# Altium project auto_threader.PrjPcb (part 2 of 3)
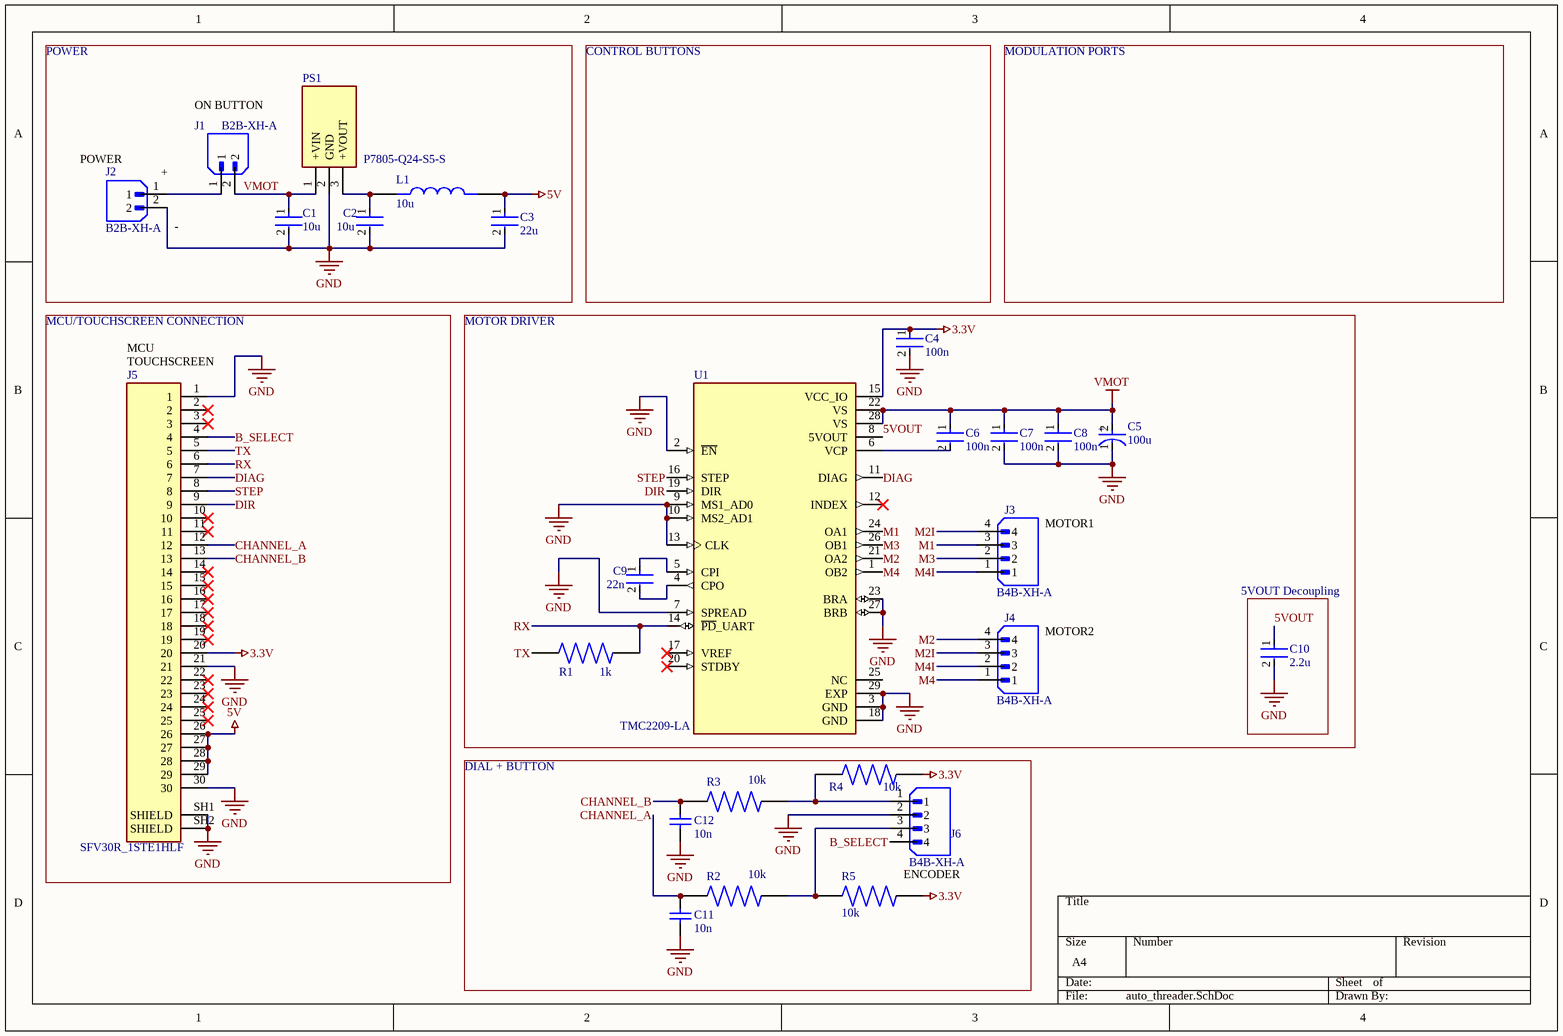
[diagram p1: auto_threader.SchDoc]

## Sheet auto_threader.SchDoc (continued)
### Library data of the parts
C1 = GRM21BR61H106KE43L: 50V 10uF X5R ±10% 0805 Multilayer Ceramic Capacitors MLCC - SMD/SMT ROHS; Manufacturer: Murata; Manufacturer Lifecycle Status: IN PRODUCTION; Value: 10µF; Supplier: DigiKey; Supplier Part Number: 490-18663-1-ND; Manufacturer Part Number: GRM21BR61H106KE43L; RoHS: Compliant; Category: Ceramic Capacitors; Stock: 1260835; Pricing: 1=0.31, 10=0.183, 50=0.133, 100=0.1177, 500=0.09208, 1000=0.08416 (USD); Case/Package: 0805; Country of Origin: Japan, Mainland China, Philippines, Singapore, Thailand; Dielectric: X5R; Dielectric Material: Ceramic; Export Control Classification Number (ECCN) Code: EAR99; Height: 1.25mm; Harmonized Tariff Schedule (HTS) Code: 8532.24.00.20; Introduction Date: 2018-09-13; Length: 2mm; Lifecycle Status: Production; Material: Ceramic; Max Operating Temperature: 85°C; Min Operating Temperature: -55°C; Mounting Technology: Surface Mount; Number of Terminals: 2; REACH SVHC: Yes; Thickness: 1.25mm; Tolerance: 10%; Voltage Rating: 50V; Voltage Rating (DC): 50V; Width: 1.25mm; ComponentLink1URL: https://datasheet.octopart.com:443/GRM21BR61H106KE43L-Murata-datasheet-155345082.pdf?src-supplier=Newark; ComponentLink1Description: https://datasheet.octopart.com:443/GRM21BR61H106KE43L-Murata-datasheet-155345082.pdf?src-supplier=Newark; ComponentLink2URL: https://datasheet.octopart.com:443/GRM21BR61H106KE43L-Murata-datasheet-141278272.pdf?src-supplier=Geoflip; ComponentLink2Description: https://datasheet.octopart.com:443/GRM21BR61H106KE43L-Murata-datasheet-141278272.pdf?src-supplier=Geoflip; ComponentLink3URL: https://datasheet.octopart.com:443/GRM21BR61H106KE43L-Murata-datasheet-165579666.pdf?src-supplier=TME; ComponentLink3Description: https://datasheet.octopart.com:443/GRM21BR61H106KE43L-Murata-datasheet-165579666.pdf?src-supplier=TME; ComponentLink4URL: https://datasheet.octopart.com:443/GRM21BR61H106KE43L-Murata-datasheet-140707579.pdf?src-supplier=Ciiva; ComponentLink4Description: https://datasheet.octopart.com:443/GRM21BR61H106KE43L-Murata-datasheet-140707579.pdf?src-supplier=Ciiva; ComponentLink5URL: https://datasheet.octopart.com:443/GRM21BR61H106KE43L-Murata-datasheet-138744880.pdf?src-supplier=Ciiva; ComponentLink5Description: https://datasheet.octopart.com:443/GRM21BR61H106KE43L-Murata-datasheet-138744880.pdf?src-supplier=Ciiva; ComponentLink6URL: https://datasheet.octopart.com/GRM21BR61H106KE43L-Murata-datasheet-12515295.pdf; ComponentLink6Description: https://datasheet.octopart.com/GRM21BR61H106KE43L-Murata-datasheet-12515295.pdf; ComponentLink7URL: https://datasheet.octopart.com/GRM21BR61H106KE43L-Murata-datasheet-12510076.pdf; ComponentLink7Description: https://datasheet.octopart.com/GRM21BR61H106KE43L-Murata-datasheet-12510076.pdf; ComponentLink8URL: https://datasheet.octopart.com/GRM21BR61H106KE43L-Murata-datasheet-11978611.pdf; ComponentLink8Description: https://datasheet.octopart.com/GRM21BR61H106KE43L-Murata-datasheet-11978611.pdf; ComponentLink9URL: https://datasheet.octopart.com/GRM21BR61H106KE43L-Murata-datasheet-10025737.pdf; ComponentLink9Description: https://datasheet.octopart.com/GRM21BR61H106KE43L-Murata-datasheet-10025737.pdf; ComponentLink10URL: https://datasheet.octopart.com/GRM21BR61H106KE43L-Murata-datasheet-8819587.pdf; ComponentLink10Description: https://datasheet.octopart.com/GRM21BR61H106KE43L-Murata-datasheet-8819587.pdf; ComponentLink11URL: http://sigma.octopart.com:80/reach_statement/Murata-company-16.pdf?src-supplier=Compliance+Statements; ComponentLink11Description: http://sigma.octopart.com:80/reach_statement/Murata-company-16.pdf?src-supplier=Compliance+Statements; Supplier 1: DigiKey; Supplier Part Number 1: 490-18663-1-ND
C2 = GRM21BR71A106KA73L: Chip Multilayer Ceramic Capacitors for General Purpose, 0805, 10uF, X7R, 15%, 10%, 10V; Length: 2mm; Case Code (Metric): 2012; Height: 1.25mm; Tolerance: 10%; Width: 1.25mm; Voltage Rating: 10V; Voltage Rating (DC): 10V; Case/Package: 0805; Package Quantity: 3000; Capacitance: 10uF; REACH SVHC: No SVHC; Case Code (Imperial): 0805; Min Operating Temperature: -55°C; Termination: SMD/SMT; Depth: 1.25mm; Mount: Surface Mount; Thickness: 0.055inch; Max Operating Temperature: 125°C; Weight: 0.000335oz; Dielectric: X7R; Packaging: Tape and Reel; Supplier 1: DigiKey; Supplier Part Number 1: 490-10516-1-ND
C3 = GRM188R61A226ME15D: 10V 22uF X5R ±20% 0603 Multilayer Ceramic Capacitors MLCC - SMD/SMT ROHS; Manufacturer: Murata; Manufacturer Lifecycle Status: IN PRODUCTION; Value: 22µF; Supplier: DigiKey; Supplier Part Number: 490-10476-1-ND; Manufacturer Part Number: GRM188R61A226ME15D; RoHS: Compliant; Category: Ceramic Capacitors; Stock: 3792271; Pricing: 1=0.16, 10=0.089, 50=0.0628, 100=0.0546, 500=0.04104, 1000=0.03687 (USD); Case/Package: 0603; Case Code (Imperial): 0603; Case Code (Metric): 1608; Depth: 800µm; Dielectric: X5R; Dielectric Material: Ceramic; Height: 800µm; Lead Free: Lead Free; Length: 1.6mm; Lifecycle Status: Production; Material: Ceramic; Max Operating Temperature: 85°C; Min Operating Temperature: -55°C; Mounting Technology: Surface Mount; Number of Terminals: 2; REACH SVHC: Yes; Schedule B: 8532240020, 8532240020|8532240020|8532240020|8532240020|8532240020|8532240020|8532240020|8532240020|8532240020|8532240020|8532240020|8532240020|8532240020|8532240020|8532240020|8532240020|8532240020|8532240020|8532240020|8532240020|8532240020|8532240020|8532240020|85; Termination: SMD/SMT; Thickness: 800µm; Tolerance: 20%; Voltage Rating: 10V; Voltage Rating (DC): 10V; Weight: 6.293594mg; Width: 800µm; ComponentLink1URL: https://datasheet.octopart.com:443/GRM188R61A226ME15D-Murata-datasheet-27203393.pdf?src-supplier=Newark; ComponentLink1Description: https://datasheet.octopart.com:443/GRM188R61A226ME15D-Murata-datasheet-27203393.pdf?src-supplier=Newark; ComponentLink2URL: https://datasheet.octopart.com:443/GRM188R61A226ME15D-Murata-datasheet-62317190.pdf?src-supplier=element14+APAC; ComponentLink2Description: https://datasheet.octopart.com:443/GRM188R61A226ME15D-Murata-datasheet-62317190.pdf?src-supplier=element14+APAC; ComponentLink3URL: https://datasheet.octopart.com:443/GRM188R61A226ME15D-Murata-datasheet-165579666.pdf?src-supplier=TME; ComponentLink3Description: https://datasheet.octopart.com:443/GRM188R61A226ME15D-Murata-datasheet-165579666.pdf?src-supplier=TME; ComponentLink4URL: https://datasheet.octopart.com:443/GRM188R61A226ME15D-Murata-datasheet-81639591.pdf?src-supplier=TME; ComponentLink4Description: https://datasheet.octopart.com:443/GRM188R61A226ME15D-Murata-datasheet-81639591.pdf?src-supplier=TME; ComponentLink5URL: https://datasheet.octopart.com:443/GRM188R61A226ME15D-Murata-datasheet-141274968.pdf?src-supplier=Ciiva; ComponentLink5Description: https://datasheet.octopart.com:443/GRM188R61A226ME15D-Murata-datasheet-141274968.pdf?src-supplier=Ciiva; ComponentLink6URL: https://datasheet.octopart.com:443/GRM188R61A226ME15D-Murata-datasheet-140704447.pdf?src-supplier=Ciiva; ComponentLink6Description: https://datasheet.octopart.com:443/GRM188R61A226ME15D-Murata-datasheet-140704447.pdf?src-supplier=Ciiva; ComponentLink7URL: https://datasheet.octopart.com:443/GRM188R61A226ME15D-Murata-datasheet-138742833.pdf?src-supplier=Ciiva; ComponentLink7Description: https://datasheet.octopart.com:443/GRM188R61A226ME15D-Murata-datasheet-138742833.pdf?src-supplier=Ciiva; ComponentLink8URL: https://datasheet.octopart.com/GRM188R61A226ME15D-Murata-datasheet-12515295.pdf; ComponentLink8Description: https://datasheet.octopart.com/GRM188R61A226ME15D-Murata-datasheet-12515295.pdf; ComponentLink9URL: https://datasheet.octopart.com/GRM188R61A226ME15D-Murata-datasheet-12510076.pdf; ComponentLink9Description: https://datasheet.octopart.com/GRM188R61A226ME15D-Murata-datasheet-12510076.pdf; ComponentLink10URL: https://datasheet.octopart.com/GRM188R61A226ME15D-Murata-datasheet-11978611.pdf; ComponentLink10Description: https://datasheet.octopart.com/GRM188R61A226ME15D-Murata-datasheet-11978611.pdf; ComponentLink11URL: https://datasheet.octopart.com/GRM188R61A226ME15D-Murata-datasheet-10025737.pdf; ComponentLink11Description: https://datasheet.octopart.com/GRM188R61A226ME15D-Murata-datasheet-10025737.pdf; ComponentLink12URL: https://datasheet.octopart.com/GRM188R61A226ME15D-Murata-datasheet-8819587.pdf; ComponentLink12Description: https://datasheet.octopart.com/GRM188R61A226ME15D-Murata-datasheet-8819587.pdf; ComponentLink13URL: https://datasheet.octopart.com/GRM188R61A226ME15D-Murata-datasheet-38883270.pdf; ComponentLink13Description: https://datasheet.octopart.com/GRM188R61A226ME15D-Murata-datasheet-38883270.pdf; ComponentLink14URL: https://datasheet.octopart.com:443/GRM188R61A226ME15D-Murata-datasheet-62287447.pdf?src-supplier=Future+Electronics; ComponentLink14Description: https://datasheet.octopart.com:443/GRM188R61A226ME15D-Murata-datasheet-62287447.pdf?src-supplier=Future+Electronics; ComponentLink15URL: http://sigma.octopart.com:80/reach_statement/Murata-company-16.pdf?src-supplier=Compliance+Statements; ComponentLink15Description: http://sigma.octopart.com:80/reach_statement/Murata-company-16.pdf?src-supplier=Compliance+Statements; Supplier 1: DigiKey; Supplier Part Number 1: 490-10476-1-ND
C4 C6-C8 = CC0805KRX7R9BB104: 50V 100nF X7R ±10% 0805 Multilayer Ceramic Capacitors MLCC - SMD/SMT ROHS; Manufacturer: Yageo Group; Manufacturer Package Identifier: CC0805-0.85; Insulation Resistance: 100GΩ; Supplier: DigiKey; Supplier Part Number: 311-1140-1-ND; Manufacturer Part Number: CC0805KRX7R9BB104; RoHS: Compliant; Category: Ceramic Capacitors; Stock: 986511; Pricing: 1=0.11, 10=0.06, 50=0.0412, 100=0.0356, 500=0.02612, 1000=0.02323 (USD); Value: 100nF; Case/Package: 0805; Case Code (Imperial): 0805; Case Code (Metric): 2012; China RoHS: Compliant; Country of Origin: Mainland China, Taiwan; Depth: 1.25mm; Dielectric: X7R; Dielectric Material: Ceramic; Export Control Classification Number (ECCN) Code: EAR99; Halogen Free: Halogen Free; Height: 850µm; Harmonized Tariff Schedule (HTS) Code: 8532.24.00.20; Introduction Date: 2003-01-27; Lead Free: Lead Free; Length: 2mm; Lifecycle Status: Production; Material: Ceramic; Max Operating Temperature: 125°C; Min Operating Temperature: -55°C; Mounting Technology: Surface Mount; Pins: 2; Number of Terminals: 2; Packaging: Cut Tape; Radiation Hardening: No; REACH SVHC: Yes; Schedule B: 8532240020, 8532240020|8532240020|8532240020|8532240020|8532240020|8532240020|8532240020|8532240020|8532240020|8532240020|8532240020|8532240020|8532240020|8532240020|8532240020|8532240020, 8532240020|8532240020|8532240020|8532240020|8532240020|8532240020|8532240020|8532240020|8532240020|8532240020|8532240020|8532240020|8532240020|8532240020|8532240020|8532240020|8532240020, 8532240020|8532240020|8532240020|8532240020|8532240020|8532240020|8532240020|8532240020|8532240020|8532240020|8532240020|8532240020|8532240020|8532240020|8532240020|8532240020|8532240020|8532240020; Termination: SMD/SMT; Thickness: 838.2µm; Tolerance: 10%; Voltage: 50V; Voltage Rating: 50V; Voltage Rating (DC): 50V; Width: 1.25mm; ComponentLink1URL: https://datasheet.octopart.com:443/CC0805KRX7R9BB104-Yageo-datasheet-177165144.pdf?src-supplier=IHS; ComponentLink1Description: https://datasheet.octopart.com:443/CC0805KRX7R9BB104-Yageo-datasheet-177165144.pdf?src-supplier=IHS; ComponentLink2URL: https://datasheet.octopart.com:443/CC0805KRX7R9BB104-Yageo-datasheet-78855689.pdf?src-supplier=Upverter; ComponentLink2Description: https://datasheet.octopart.com:443/CC0805KRX7R9BB104-Yageo-datasheet-78855689.pdf?src-supplier=Upverter; ComponentLink3URL: https://datasheet.octopart.com:443/CC0805KRX7R9BB104-Yageo-datasheet-68298032.pdf?src-supplier=Upverter; ComponentLink3Description: https://datasheet.octopart.com:443/CC0805KRX7R9BB104-Yageo-datasheet-68298032.pdf?src-supplier=Upverter; ComponentLink4URL: https://datasheet.octopart.com:443/CC0805KRX7R9BB104-Yageo-Group-datasheet-189192896.pdf?src-supplier=Future+Electronics; ComponentLink4Description: https://datasheet.octopart.com:443/CC0805KRX7R9BB104-Yageo-Group-datasheet-189192896.pdf?src-supplier=Future+Electronics; ComponentLink5URL: https://datasheet.octopart.com:443/CC0805KRX7R9BB104-Yageo-datasheet-166511530.pdf?src-supplier=Future+Electronics; ComponentLink5Description: https://datasheet.octopart.com:443/CC0805KRX7R9BB104-Yageo-datasheet-166511530.pdf?src-supplier=Future+Electronics; ComponentLink6URL: https://datasheet.octopart.com:443/CC0805KRX7R9BB104-Yageo-datasheet-137700082.pdf?src-supplier=Future+Electronics; ComponentLink6Description: https://datasheet.octopart.com:443/CC0805KRX7R9BB104-Yageo-datasheet-137700082.pdf?src-supplier=Future+Electronics; ComponentLink7URL: https://datasheet.octopart.com:443/CC0805KRX7R9BB104-Yageo-datasheet-137700084.pdf?src-supplier=Future+Electronics; ComponentLink7Description: https://datasheet.octopart.com:443/CC0805KRX7R9BB104-Yageo-datasheet-137700084.pdf?src-supplier=Future+Electronics; ComponentLink8URL: https://datasheet.octopart.com:443/CC0805KRX7R9BB104-Yageo-datasheet-82288757.pdf?src-supplier=Future+Electronics; ComponentLink8Description: https://datasheet.octopart.com:443/CC0805KRX7R9BB104-Yageo-datasheet-82288757.pdf?src-supplier=Future+Electronics; ComponentLink9URL: https://datasheet.octopart.com:443/CC0805KRX7R9BB104-Yageo-datasheet-62139192.pdf?src-supplier=Future+Electronics; ComponentLink9Description: https://datasheet.octopart.com:443/CC0805KRX7R9BB104-Yageo-datasheet-62139192.pdf?src-supplier=Future+Electronics; ComponentLink10URL: https://datasheet.octopart.com:443/CC0805KRX7R9BB104-Yageo-datasheet-27626582.pdf?src-supplier=Future+Electronics; ComponentLink10Description: https://datasheet.octopart.com:443/CC0805KRX7R9BB104-Yageo-datasheet-27626582.pdf?src-supplier=Future+Electronics; ComponentLink11URL: https://datasheet.octopart.com:443/CC0805KRX7R9BB104-Yageo-datasheet-15895757.pdf?src-supplier=Future+Electronics; ComponentLink11Description: https://datasheet.octopart.com:443/CC0805KRX7R9BB104-Yageo-datasheet-15895757.pdf?src-supplier=Future+Electronics; ComponentLink12URL: https://datasheet.octopart.com:443/CC0805KRX7R9BB104-Yageo-datasheet-12526321.pdf?src-supplier=Future+Electronics; ComponentLink12Description: https://datasheet.octopart.com:443/CC0805KRX7R9BB104-Yageo-datasheet-12526321.pdf?src-supplier=Future+Electronics; ComponentLink13URL: https://datasheet.octopart.com:443/CC0805KRX7R9BB104-Yageo-datasheet-8324192.pdf?src-supplier=Future+Electronics; ComponentLink13Description: https://datasheet.octopart.com:443/CC0805KRX7R9BB104-Yageo-datasheet-8324192.pdf?src-supplier=Future+Electronics; ComponentLink14URL: https://datasheet.octopart.com/CC0805KRX7R9BB104-Yageo-datasheet-10883670.pdf; ComponentLink14Description: https://datasheet.octopart.com/CC0805KRX7R9BB104-Yageo-datasheet-10883670.pdf; ComponentLink15URL: https://datasheet.octopart.com:443/CC0805KRX7R9BB104-Yageo-datasheet-62336348.pdf?src-supplier=Newark; ComponentLink15Description: https://datasheet.octopart.com:443/CC0805KRX7R9BB104-Yageo-datasheet-62336348.pdf?src-supplier=Newark; ComponentLink16URL: https://datasheet.octopart.com:443/CC0805KRX7R9BB104-Yageo-datasheet-181969852.pdf?src-supplier=Newark; ComponentLink16Description: https://datasheet.octopart.com:443/CC0805KRX7R9BB104-Yageo-datasheet-181969852.pdf?src-supplier=Newark; ComponentLink17URL: https://datasheet.octopart.com:443/CC0805KRX7R9BB104-Yageo-datasheet-181969851.pdf?src-supplier=Newark; ComponentLink17Description: https://datasheet.octopart.com:443/CC0805KRX7R9BB104-Yageo-datasheet-181969851.pdf?src-supplier=Newark; ComponentLink18URL: https://datasheet.octopart.com:443/CC0805KRX7R9BB104-Phycomp-datasheet-499490.pdf?src-supplier=Newark; ComponentLink18Description: https://datasheet.octopart.com:443/CC0805KRX7R9BB104-Phycomp-datasheet-499490.pdf?src-supplier=Newark; ComponentLink19URL: https://datasheet.octopart.com:443/CC0805KRX7R9BB104-Yageo-datasheet-147453679.pdf?src-supplier=element14+APAC; ComponentLink19Description: https://datasheet.octopart.com:443/CC0805KRX7R9BB104-Yageo-datasheet-147453679.pdf?src-supplier=element14+APAC; ComponentLink20URL: https://datasheet.octopart.com:443/CC0805KRX7R9BB104-Yageo-datasheet-151948686.pdf?src-supplier=Farnell; ComponentLink20Description: https://datasheet.octopart.com:443/CC0805KRX7R9BB104-Yageo-datasheet-151948686.pdf?src-supplier=Farnell; ComponentLink21URL: https://datasheet.octopart.com:443/CC0805KRX7R9BB104-Yageo-Group-datasheet-188689702.pdf?src-supplier=Farnell; ComponentLink21Description: https://datasheet.octopart.com:443/CC0805KRX7R9BB104-Yageo-Group-datasheet-188689702.pdf?src-supplier=Farnell; ComponentLink22URL: https://datasheet.octopart.com:443/CC0805KRX7R9BB104-Phycomp-datasheet-500777.pdf?src-supplier=Farnell; ComponentLink22Description: https://datasheet.octopart.com:443/CC0805KRX7R9BB104-Phycomp-datasheet-500777.pdf?src-supplier=Farnell; ComponentLink23URL: https://datasheet.octopart.com:443/CC0805KRX7R9BB104-Yageo-Group-datasheet-165992755.pdf?src-supplier=ODG+(Origin+Data+Global); ComponentLink23Description: https://datasheet.octopart.com:443/CC0805KRX7R9BB104-Yageo-Group-datasheet-165992755.pdf?src-supplier=ODG+(Origin+Data+Global); ComponentLink24URL: https://datasheet.octopart.com:443/CC0805KRX7R9BB104-Yageo-datasheet-140260305.pdf?src-supplier=SOS+electronic; ComponentLink24Description: https://datasheet.octopart.com:443/CC0805KRX7R9BB104-Yageo-datasheet-140260305.pdf?src-supplier=SOS+electronic; ComponentLink25URL: https://datasheet.octopart.com:443/CC0805KRX7R9BB104-Yageo-datasheet-120101875.pdf?src-supplier=Megastar; ComponentLink25Description: https://datasheet.octopart.com:443/CC0805KRX7R9BB104-Yageo-datasheet-120101875.pdf?src-supplier=Megastar; ComponentLink26URL: https://datasheet.octopart.com:443/CC0805KRX7R9BB104-Yageo-datasheet-8701427.pdf?src-supplier=element14; ComponentLink26Description: https://datasheet.octopart.com:443/CC0805KRX7R9BB104-Yageo-datasheet-8701427.pdf?src-supplier=element14; ComponentLink27URL: https://datasheet.octopart.com:443/CC0805KRX7R9BB104-Yageo-datasheet-5301394.pdf?src-supplier=element14; ComponentLink27Description: https://datasheet.octopart.com:443/CC0805KRX7R9BB104-Yageo-datasheet-5301394.pdf?src-supplier=element14; ComponentLink28URL: https://datasheet.octopart.com:443/CC0805KRX7R9BB104-Yageo-datasheet-17600895.pdf?src-supplier=TME; ComponentLink28Description: https://datasheet.octopart.com:443/CC0805KRX7R9BB104-Yageo-datasheet-17600895.pdf?src-supplier=TME; ComponentLink29URL: https://datasheet.octopart.com:443/CC0805KRX7R9BB104-Yageo-datasheet-118396.pdf?src-supplier=DigiKey; ComponentLink29Description: https://datasheet.octopart.com:443/CC0805KRX7R9BB104-Yageo-datasheet-118396.pdf?src-supplier=DigiKey; ComponentLink30URL: http://sigma.octopart.com:80/conflict_mineral_statement/Yageo-company-3.pdf?src-supplier=Compliance+Statements; ComponentLink30Description: http://sigma.octopart.com:80/conflict_mineral_statement/Yageo-company-3.pdf?src-supplier=Compliance+Statements; ComponentLink31URL: http://sigma.octopart.com:80/rohs_statement/Yageo-company-2.pdf?src-supplier=Compliance+Statements; ComponentLink31Description: http://sigma.octopart.com:80/rohs_statement/Yageo-company-2.pdf?src-supplier=Compliance+Statements; Supplier 1: DigiKey; Supplier Part Number 1: 311-1140-1-ND
C5 = 35ZLH100MEFC6.3X11: Aluminum Electrolytic Capacitors-DIP DIP, D6.3xL11mm 100μF ±20% 35V 94mΩ 540mA 6000Hrs@105℃; Manufacturer: Rubycon; Dielectric Material: Aluminium; Dissipation Factor: 12%; Lead Diameter: 500µm; Leakage Current: 35µA; Life (Hours): 6000hours; Ripple Current: 270mA; Supplier: DigiKey; Supplier Part Number: 1189-1300-ND; Manufacturer Part Number: 35ZLH100MEFC6.3X11; RoHS: Compliant; Category: Aluminum Electrolytic Capacitors; Stock: 118937; Pricing: 1=0.33, 10=0.203, 50=0.148, 100=0.1304, 500=0.09992, 2000=0.08229, 4000=0.07562, 6000=0.07225 (USD); Value: 100µF; Case/Package: Radial; Country of Origin: Japan; Diameter: 6.3mm; Export Control Classification Number (ECCN) Code: EAR99; Height: 12.5mm; Height - Seated (Max): 12.4968mm; Harmonized Tariff Schedule (HTS) Code: 8532.22.00.20; Impedance: 94mΩ; Introduction Date: 2010-09-20; Lead Pitch: 2.5mm; Length: 11mm; Lifecycle Status: Production; Max Operating Temperature: 105°C; Min Operating Temperature: -40°C; Mounting Technology: Through Hole; Pins: 2; Number of Terminals: 2; Packaging: Bulk; Radiation Hardening: No; REACH SVHC: Yes; Ripple Current (AC): 540mA; Schedule B: 8532220020, 8532220020|8532220020|8532220020|8532220020|8532220020|8532220020|8532220020|8532220020|8532220020|8532220020|8532220020|8532220020|8532220020|8532220020|8532220020|8532220020|8532220020|8532220020|8532220020|8532220020|8532220020|8532220020|8532220020|85; Terminal Pitch: 2.5mm; Termination: Radial; Tolerance: 20%; Voltage: 35V; Voltage Rating: 35V; Voltage Rating (AC): 35V; Voltage Rating (DC): 35V; ComponentLink1URL: https://datasheet.octopart.com:443/35ZLH100MEFC6.3X11-Rubycon-datasheet-181960486.pdf?src-supplier=IHS; ComponentLink1Description: https://datasheet.octopart.com:443/35ZLH100MEFC6.3X11-Rubycon-datasheet-181960486.pdf?src-supplier=IHS; ComponentLink2URL: https://datasheet.octopart.com:443/35ZLH100MEFC6.3X11-Rubycon-datasheet-12510202.pdf?src-supplier=LKR; ComponentLink2Description: https://datasheet.octopart.com:443/35ZLH100MEFC6.3X11-Rubycon-datasheet-12510202.pdf?src-supplier=LKR; ComponentLink3URL: https://datasheet.octopart.com:443/35ZLH100MEFC6.3X11-Rubycon-datasheet-154841597.pdf?src-supplier=JRH+Electronics; ComponentLink3Description: https://datasheet.octopart.com:443/35ZLH100MEFC6.3X11-Rubycon-datasheet-154841597.pdf?src-supplier=JRH+Electronics; ComponentLink4URL: https://datasheet.octopart.com:443/35ZLH100MEFC6.3X11-Rubycon-datasheet-66579747.pdf?src-supplier=Newark; ComponentLink4Description: https://datasheet.octopart.com:443/35ZLH100MEFC6.3X11-Rubycon-datasheet-66579747.pdf?src-supplier=Newark; ComponentLink5URL: https://datasheet.octopart.com:443/35ZLH100MEFC6.3X11-Rubycon-datasheet-41194731.pdf?src-supplier=Newark; ComponentLink5Description: https://datasheet.octopart.com:443/35ZLH100MEFC6.3X11-Rubycon-datasheet-41194731.pdf?src-supplier=Newark; ComponentLink6URL: https://datasheet.octopart.com:443/35ZLH100MEFC6.3X11-Rubycon-datasheet-10030022.pdf?src-supplier=element14+APAC; ComponentLink6Description: https://datasheet.octopart.com:443/35ZLH100MEFC6.3X11-Rubycon-datasheet-10030022.pdf?src-supplier=element14+APAC; ComponentLink7URL: https://datasheet.octopart.com:443/35ZLH100MEFC6.3X11-Rubycon-datasheet-8493648.pdf?src-supplier=element14+APAC; ComponentLink7Description: https://datasheet.octopart.com:443/35ZLH100MEFC6.3X11-Rubycon-datasheet-8493648.pdf?src-supplier=element14+APAC; ComponentLink8URL: https://datasheet.octopart.com:443/35ZLH100MEFC6.3X11-Rubycon-datasheet-7128063.pdf?src-supplier=element14+APAC; ComponentLink8Description: https://datasheet.octopart.com:443/35ZLH100MEFC6.3X11-Rubycon-datasheet-7128063.pdf?src-supplier=element14+APAC; ComponentLink9URL: https://datasheet.octopart.com:443/35ZLH100MEFC6.3X11-Rubycon-datasheet-86451566.pdf?src-supplier=Master+Electronics; ComponentLink9Description: https://datasheet.octopart.com:443/35ZLH100MEFC6.3X11-Rubycon-datasheet-86451566.pdf?src-supplier=Master+Electronics; Supplier 1: DigiKey; Supplier Part Number 1: 1189-1300-ND
C9 = CC0603KRX7R9BB223: Surface Mount Ceramic Multilayer Capacitor 0.022uF 10% X7R 50V 0603 Paper T/R; Manufacturer: Yageo Group; Value: 22nF; Insulation Resistance: 100GΩ; Supplier: DigiKey; Supplier Part Number: 311-1370-1-ND; Manufacturer Part Number: CC0603KRX7R9BB223; RoHS: Compliant; Category: Ceramic Capacitors; Stock: 1263; Pricing: 1=0.1, 10=0.042, 50=0.0288, 100=0.0247, 500=0.01782, 1000=0.0157 (USD); Case/Package: 0603; Case Code (Imperial): 0603; Case Code (Metric): 1608; China RoHS: Compliant; Composition: Ceramic; Country of Origin: Mainland China, Taiwan; Depth: 800µm; Dielectric: X7R; Dielectric Material: Ceramic; Export Control Classification Number (ECCN) Code: EAR99; Halogen Free: Halogen Free; Height: 800µm; Harmonized Tariff Schedule (HTS) Code: 8532.24.00.20; Introduction Date: 2003-01-27; Lead Free: Lead Free; Length: 1.6mm; Lifecycle Status: Production; Material: Ceramic; Max Operating Temperature: 125°C; Min Operating Temperature: -55°C; Mounting Technology: Surface Mount; Pins: 2; Number of Terminals: 2; Packaging: Cut Tape (CT); Radiation Hardening: No; REACH SVHC: Yes; Schedule B: 8532240020, 8532240020|8532240020, 8532240020|8532240020|8532240020, 8532240020|8532240020|8532240020|8532240020; Termination: SMD/SMT; Thickness: 889µm; Tolerance: 10%; Voltage: 50V; Voltage Rating: 50V; Voltage Rating (AC): 50V; Voltage Rating (DC): 50V; Width: 800µm; ComponentLink1URL: https://datasheet.octopart.com:443/CC0603KRX7R9BB223-Yageo-datasheet-177165144.pdf?src-supplier=IHS; ComponentLink1Description: https://datasheet.octopart.com:443/CC0603KRX7R9BB223-Yageo-datasheet-177165144.pdf?src-supplier=IHS; ComponentLink2URL: https://datasheet.octopart.com/CC0603KRX7R9BB223-Yageo-datasheet-10883670.pdf; ComponentLink2Description: https://datasheet.octopart.com/CC0603KRX7R9BB223-Yageo-datasheet-10883670.pdf; ComponentLink3URL: https://datasheet.octopart.com:443/CC0603KRX7R9BB223-Yageo-datasheet-147453679.pdf?src-supplier=Newark; ComponentLink3Description: https://datasheet.octopart.com:443/CC0603KRX7R9BB223-Yageo-datasheet-147453679.pdf?src-supplier=Newark; ComponentLink4URL: https://datasheet.octopart.com:443/CC0603KRX7R9BB223-Yageo-datasheet-499490.pdf?src-supplier=Newark; ComponentLink4Description: https://datasheet.octopart.com:443/CC0603KRX7R9BB223-Yageo-datasheet-499490.pdf?src-supplier=Newark; ComponentLink5URL: https://datasheet.octopart.com:443/CC0603KRX7R9BB223-Yageo-datasheet-5301394.pdf?src-supplier=Newark; ComponentLink5Description: https://datasheet.octopart.com:443/CC0603KRX7R9BB223-Yageo-datasheet-5301394.pdf?src-supplier=Newark; ComponentLink6URL: https://sigma.octopart.com:443/147830939/technical_drawing/Yageo-CC0603KRX7R9BB223.pdf?src-supplier=Upverter; ComponentLink6Description: https://sigma.octopart.com:443/147830939/technical_drawing/Yageo-CC0603KRX7R9BB223.pdf?src-supplier=Upverter; ComponentLink7URL: https://datasheet.octopart.com:443/CC0603KRX7R9BB223-Yageo-datasheet-82288757.pdf?src-supplier=Upverter; ComponentLink7Description: https://datasheet.octopart.com:443/CC0603KRX7R9BB223-Yageo-datasheet-82288757.pdf?src-supplier=Upverter; ComponentLink8URL: https://datasheet.octopart.com:443/CC0603KRX7R9BB223-Yageo-datasheet-62139192.pdf?src-supplier=Upverter; ComponentLink8Description: https://datasheet.octopart.com:443/CC0603KRX7R9BB223-Yageo-datasheet-62139192.pdf?src-supplier=Upverter; ComponentLink9URL: https://datasheet.octopart.com:443/CC0603KRX7R9BB223-Yageo-Group-datasheet-189192896.pdf?src-supplier=Future+Electronics; ComponentLink9Description: https://datasheet.octopart.com:443/CC0603KRX7R9BB223-Yageo-Group-datasheet-189192896.pdf?src-supplier=Future+Electronics; ComponentLink10URL: https://datasheet.octopart.com:443/CC0603KRX7R9BB223-Yageo-datasheet-166511530.pdf?src-supplier=Future+Electronics; ComponentLink10Description: https://datasheet.octopart.com:443/CC0603KRX7R9BB223-Yageo-datasheet-166511530.pdf?src-supplier=Future+Electronics; ComponentLink11URL: https://datasheet.octopart.com:443/CC0603KRX7R9BB223-Yageo-datasheet-137700082.pdf?src-supplier=Future+Electronics; ComponentLink11Description: https://datasheet.octopart.com:443/CC0603KRX7R9BB223-Yageo-datasheet-137700082.pdf?src-supplier=Future+Electronics; ComponentLink12URL: https://datasheet.octopart.com:443/CC0603KRX7R9BB223-Yageo-datasheet-137700084.pdf?src-supplier=Future+Electronics; ComponentLink12Description: https://datasheet.octopart.com:443/CC0603KRX7R9BB223-Yageo-datasheet-137700084.pdf?src-supplier=Future+Electronics; ComponentLink13URL: https://datasheet.octopart.com:443/CC0603KRX7R9BB223-Yageo-datasheet-15895757.pdf?src-supplier=Future+Electronics; ComponentLink13Description: https://datasheet.octopart.com:443/CC0603KRX7R9BB223-Yageo-datasheet-15895757.pdf?src-supplier=Future+Electronics; ComponentLink14URL: https://datasheet.octopart.com:443/CC0603KRX7R9BB223-Yageo-datasheet-12526321.pdf?src-supplier=Future+Electronics; ComponentLink14Description: https://datasheet.octopart.com:443/CC0603KRX7R9BB223-Yageo-datasheet-12526321.pdf?src-supplier=Future+Electronics; ComponentLink15URL: https://datasheet.octopart.com:443/CC0603KRX7R9BB223-Yageo-datasheet-8324192.pdf?src-supplier=Future+Electronics; ComponentLink15Description: https://datasheet.octopart.com:443/CC0603KRX7R9BB223-Yageo-datasheet-8324192.pdf?src-supplier=Future+Electronics; ComponentLink16URL: https://datasheet.octopart.com:443/CC0603KRX7R9BB223-Yageo-datasheet-62336348.pdf?src-supplier=Farnell; ComponentLink16Description: https://datasheet.octopart.com:443/CC0603KRX7R9BB223-Yageo-datasheet-62336348.pdf?src-supplier=Farnell; ComponentLink17URL: https://datasheet.octopart.com:443/CC0603KRX7R9BB223-Yageo-datasheet-151948686.pdf?src-supplier=Farnell; ComponentLink17Description: https://datasheet.octopart.com:443/CC0603KRX7R9BB223-Yageo-datasheet-151948686.pdf?src-supplier=Farnell; ComponentLink18URL: https://datasheet.octopart.com:443/CC0603KRX7R9BB223-Yageo-datasheet-500777.pdf?src-supplier=Farnell; ComponentLink18Description: https://datasheet.octopart.com:443/CC0603KRX7R9BB223-Yageo-datasheet-500777.pdf?src-supplier=Farnell; ComponentLink19URL: https://datasheet.octopart.com:443/CC0603KRX7R9BB223-Yageo-datasheet-27626582.pdf?src-supplier=Seeed+Studio; ComponentLink19Description: https://datasheet.octopart.com:443/CC0603KRX7R9BB223-Yageo-datasheet-27626582.pdf?src-supplier=Seeed+Studio; ComponentLink20URL: https://datasheet.octopart.com:443/CC0603KRX7R9BB223-Yageo-datasheet-178019131.pdf?src-supplier=Burklin+Elektronik; ComponentLink20Description: https://datasheet.octopart.com:443/CC0603KRX7R9BB223-Yageo-datasheet-178019131.pdf?src-supplier=Burklin+Elektronik; ComponentLink21URL: https://datasheet.octopart.com:443/CC0603KRX7R9BB223-Yageo-Group-datasheet-165992755.pdf?src-supplier=ODG+(Origin+Data+Global); ComponentLink21Description: https://datasheet.octopart.com:443/CC0603KRX7R9BB223-Yageo-Group-datasheet-165992755.pdf?src-supplier=ODG+(Origin+Data+Global); ComponentLink22URL: https://datasheet.octopart.com:443/CC0603KRX7R9BB223-Yageo-datasheet-140260305.pdf?src-supplier=SOS+electronic; ComponentLink22Description: https://datasheet.octopart.com:443/CC0603KRX7R9BB223-Yageo-datasheet-140260305.pdf?src-supplier=SOS+electronic; ComponentLink23URL: https://datasheet.octopart.com:443/CC0603KRX7R9BB223-Yageo-datasheet-120101875.pdf?src-supplier=Megastar; ComponentLink23Description: https://datasheet.octopart.com:443/CC0603KRX7R9BB223-Yageo-datasheet-120101875.pdf?src-supplier=Megastar; ComponentLink24URL: https://datasheet.octopart.com:443/CC0603KRX7R9BB223-Yageo-datasheet-8701427.pdf?src-supplier=element14; ComponentLink24Description: https://datasheet.octopart.com:443/CC0603KRX7R9BB223-Yageo-datasheet-8701427.pdf?src-supplier=element14; ComponentLink25URL: https://datasheet.octopart.com:443/CC0603KRX7R9BB223-Yageo-datasheet-17600895.pdf?src-supplier=TME; ComponentLink25Description: https://datasheet.octopart.com:443/CC0603KRX7R9BB223-Yageo-datasheet-17600895.pdf?src-supplier=TME; ComponentLink26URL: http://sigma.octopart.com:80/conflict_mineral_statement/Yageo-company-3.pdf?src-supplier=Compliance+Statements; ComponentLink26Description: http://sigma.octopart.com:80/conflict_mineral_statement/Yageo-company-3.pdf?src-supplier=Compliance+Statements; ComponentLink27URL: http://sigma.octopart.com:80/rohs_statement/Yageo-company-2.pdf?src-supplier=Compliance+Statements; ComponentLink27Description: http://sigma.octopart.com:80/rohs_statement/Yageo-company-2.pdf?src-supplier=Compliance+Statements; Supplier 1: DigiKey; Supplier Part Number 1: 311-1370-1-ND
C10 = GRM155C80J225KE95D: 6.3V 2.2uF X6S ±10% 0402 Multilayer Ceramic Capacitors MLCC - SMD/SMT ROHS; Manufacturer: Murata; Manufacturer Lifecycle Status: IN PRODUCTION; Value: 2.2µF; Supplier: DigiKey; Supplier Part Number: 490-10012-1-ND; Manufacturer Part Number: GRM155C80J225KE95D; RoHS: Compliant; Category: Ceramic Capacitors; Stock: 4107485; Pricing: 1=0.1, 10=0.057, 50=0.039, 100=0.0336, 500=0.02462, 1000=0.02186, 2500=0.01896, 5000=0.01722 (USD); Case/Package: 0402; Case Code (Imperial): 0402; Case Code (Metric): 1005; Country of Origin: Japan, Mainland China, Philippines, Singapore, Thailand; Dielectric: X6S; Dielectric Material: Ceramic; Export Control Classification Number (ECCN) Code: EAR99; Height: 500µm; Harmonized Tariff Schedule (HTS) Code: 8532.24.00.20; Introduction Date: 2012-07-24; Length: 1mm; Lifecycle Status: Production; Material: Ceramic; Max Operating Temperature: 105°C; Min Operating Temperature: -55°C; Mounting Technology: Surface Mount; Number of Terminals: 2; Packaging: Tape & Reel (TR); REACH SVHC: Yes; Schedule B: 8532240020, 8532240020|8532240020|8532240020|8532240020|8532240020|8532240020|8532240020|8532240020|8532240020|8532240020|8532240020|8532240020|8532240020|8532240020|8532240020|8532240020|8532240020|8532240020|8532240020|8532240020|8532240020|8532240020|8532240020|85; Thickness: 500µm; Tolerance: 10%; Voltage Rating: 6.3V; Voltage Rating (DC): 6.3V; Width: 500µm; ComponentLink1URL: https://datasheet.octopart.com:443/GRM155C80J225KE95D-Murata-datasheet-149522920.pdf?src-supplier=Newark; ComponentLink1Description: https://datasheet.octopart.com:443/GRM155C80J225KE95D-Murata-datasheet-149522920.pdf?src-supplier=Newark; ComponentLink2URL: https://datasheet.octopart.com:443/GRM155C80J225KE95D-Murata-datasheet-179080476.pdf?src-supplier=Arrow.cn; ComponentLink2Description: https://datasheet.octopart.com:443/GRM155C80J225KE95D-Murata-datasheet-179080476.pdf?src-supplier=Arrow.cn; ComponentLink3URL: https://datasheet.octopart.com:443/GRM155C80J225KE95D-Murata-datasheet-165579666.pdf?src-supplier=TME; ComponentLink3Description: https://datasheet.octopart.com:443/GRM155C80J225KE95D-Murata-datasheet-165579666.pdf?src-supplier=TME; ComponentLink4URL: https://datasheet.octopart.com:443/GRM155C80J225KE95D-Murata-datasheet-141266224.pdf?src-supplier=Ciiva; ComponentLink4Description: https://datasheet.octopart.com:443/GRM155C80J225KE95D-Murata-datasheet-141266224.pdf?src-supplier=Ciiva; ComponentLink5URL: https://datasheet.octopart.com:443/GRM155C80J225KE95D-Murata-datasheet-140688039.pdf?src-supplier=Ciiva; ComponentLink5Description: https://datasheet.octopart.com:443/GRM155C80J225KE95D-Murata-datasheet-140688039.pdf?src-supplier=Ciiva; ComponentLink6URL: https://datasheet.octopart.com:443/GRM155C80J225KE95D-Murata-datasheet-138740490.pdf?src-supplier=Ciiva; ComponentLink6Description: https://datasheet.octopart.com:443/GRM155C80J225KE95D-Murata-datasheet-138740490.pdf?src-supplier=Ciiva; ComponentLink7URL: https://datasheet.octopart.com:443/GRM155C80J225KE95D-Murata-datasheet-32479577.pdf?src-supplier=Future+Electronics; ComponentLink7Description: https://datasheet.octopart.com:443/GRM155C80J225KE95D-Murata-datasheet-32479577.pdf?src-supplier=Future+Electronics; ComponentLink8URL: https://datasheet.octopart.com/GRM155C80J225KE95D-Murata-datasheet-12515295.pdf; ComponentLink8Description: https://datasheet.octopart.com/GRM155C80J225KE95D-Murata-datasheet-12515295.pdf; ComponentLink9URL: https://datasheet.octopart.com/GRM155C80J225KE95D-Murata-datasheet-12510076.pdf; ComponentLink9Description: https://datasheet.octopart.com/GRM155C80J225KE95D-Murata-datasheet-12510076.pdf; ComponentLink10URL: https://datasheet.octopart.com/GRM155C80J225KE95D-Murata-datasheet-11978611.pdf; ComponentLink10Description: https://datasheet.octopart.com/GRM155C80J225KE95D-Murata-datasheet-11978611.pdf; ComponentLink11URL: https://datasheet.octopart.com/GRM155C80J225KE95D-Murata-datasheet-10025737.pdf; ComponentLink11Description: https://datasheet.octopart.com/GRM155C80J225KE95D-Murata-datasheet-10025737.pdf; ComponentLink12URL: https://datasheet.octopart.com/GRM155C80J225KE95D-Murata-datasheet-8819587.pdf; ComponentLink12Description: https://datasheet.octopart.com/GRM155C80J225KE95D-Murata-datasheet-8819587.pdf; ComponentLink13URL: https://datasheet.octopart.com/GRM155C80J225KE95D-Murata-datasheet-15634835.pdf; ComponentLink13Description: https://datasheet.octopart.com/GRM155C80J225KE95D-Murata-datasheet-15634835.pdf; ComponentLink14URL: http://sigma.octopart.com:80/reach_statement/Murata-company-16.pdf?src-supplier=Compliance+Statements; ComponentLink14Description: http://sigma.octopart.com:80/reach_statement/Murata-company-16.pdf?src-supplier=Compliance+Statements; Supplier 1: DigiKey; Supplier Part Number 1: 490-10012-1-ND
C11 C12 = GCM188R71H103KA37D: 50V 10nF X7R ±10% 0603 Multilayer Ceramic Capacitors MLCC - SMD/SMT ROHS; Manufacturer: Murata; Manufacturer Lifecycle Status: NRND; Supplier: DigiKey; Supplier Part Number: 490-4778-1-ND; Manufacturer Part Number: GCM188R71H103KA37D; RoHS: Compliant; Category: Ceramic Capacitors; Stock: 5464610; Pricing: 1=0.12, 10=0.065, 50=0.045, 100=0.0389, 500=0.02872, 1000=0.02559 (USD); Value: 10nF; Case/Package: 0603; Case Code (Imperial): 0603; Case Code (Metric): 1608; Country of Origin: Philippines; Depth: 800µm; Dielectric: X7R; Dielectric Material: Ceramic; Export Control Classification Number (ECCN) Code: EAR99; Height: 800µm; Harmonized Tariff Schedule (HTS) Code: 8532.24.00.20; Introduction Date: 2007-06-21; Lead Free: Lead Free; Length: 1.6mm; Lifecycle Status: NRND; Max Operating Temperature: 125°C; Min Operating Temperature: -55°C; Mounting Technology: Surface Mount; Number of Terminals: 2; Packaging: Cut Tape; Radiation Hardening: No; Ratings: AEC-Q200; REACH SVHC: Yes; Schedule B: 8532240020, 8532240020|8532240020, 8532240020|8532240020|8532240020, 8532240020|8532240020|8532240020|8532240020; Termination: SMD/SMT; Tolerance: 10%; Voltage: 50V; Voltage Rating: 50V; Voltage Rating (DC): 50V; Width: 800µm; ComponentLink1URL: https://datasheet.octopart.com:443/GCM188R71H103KA37D-Murata-datasheet-39128445.pdf?src-supplier=Newark; ComponentLink1Description: https://datasheet.octopart.com:443/GCM188R71H103KA37D-Murata-datasheet-39128445.pdf?src-supplier=Newark; ComponentLink2URL: https://datasheet.octopart.com:443/GCM188R71H103KA37D-Murata-datasheet-62316953.pdf?src-supplier=element14+APAC; ComponentLink2Description: https://datasheet.octopart.com:443/GCM188R71H103KA37D-Murata-datasheet-62316953.pdf?src-supplier=element14+APAC; ComponentLink3URL: https://datasheet.octopart.com:443/GCM188R71H103KA37D-Murata-datasheet-8332723.pdf?src-supplier=_legacy+Avnet; ComponentLink3Description: https://datasheet.octopart.com:443/GCM188R71H103KA37D-Murata-datasheet-8332723.pdf?src-supplier=_legacy+Avnet; ComponentLink4URL: https://datasheet.octopart.com:443/GCM188R71H103KA37D-Murata-datasheet-14404452.pdf?src-supplier=Future+Electronics; ComponentLink4Description: https://datasheet.octopart.com:443/GCM188R71H103KA37D-Murata-datasheet-14404452.pdf?src-supplier=Future+Electronics; ComponentLink5URL: https://datasheet.octopart.com:443/GCM188R71H103KA37D-Murata-datasheet-12532847.pdf?src-supplier=Future+Electronics; ComponentLink5Description: https://datasheet.octopart.com:443/GCM188R71H103KA37D-Murata-datasheet-12532847.pdf?src-supplier=Future+Electronics; ComponentLink6URL: https://datasheet.octopart.com:443/GCM188R71H103KA37D-Murata-datasheet-41571772.pdf?src-supplier=Future+Electronics; ComponentLink6Description: https://datasheet.octopart.com:443/GCM188R71H103KA37D-Murata-datasheet-41571772.pdf?src-supplier=Future+Electronics; ComponentLink7URL: https://datasheet.octopart.com:443/GCM188R71H103KA37D-Murata-datasheet-165579661.pdf?src-supplier=TME; ComponentLink7Description: https://datasheet.octopart.com:443/GCM188R71H103KA37D-Murata-datasheet-165579661.pdf?src-supplier=TME; ComponentLink8URL: https://datasheet.octopart.com:443/GCM188R71H103KA37D-Murata-datasheet-62117434.pdf?src-supplier=TME; ComponentLink8Description: https://datasheet.octopart.com:443/GCM188R71H103KA37D-Murata-datasheet-62117434.pdf?src-supplier=TME; ComponentLink9URL: https://datasheet.octopart.com:443/GCM188R71H103KA37D-Murata-datasheet-140658743.pdf?src-supplier=Ciiva; ComponentLink9Description: https://datasheet.octopart.com:443/GCM188R71H103KA37D-Murata-datasheet-140658743.pdf?src-supplier=Ciiva; ComponentLink10URL: https://datasheet.octopart.com:443/GCM188R71H103KA37D-Murata-datasheet-138718308.pdf?src-supplier=Ciiva; ComponentLink10Description: https://datasheet.octopart.com:443/GCM188R71H103KA37D-Murata-datasheet-138718308.pdf?src-supplier=Ciiva; ComponentLink11URL: https://datasheet.octopart.com:443/GCM188R71H103KA37D-Murata-datasheet-11836845.pdf?src-supplier=Arrow+Electronics; ComponentLink11Description: https://datasheet.octopart.com:443/GCM188R71H103KA37D-Murata-datasheet-11836845.pdf?src-supplier=Arrow+Electronics; ComponentLink12URL: http://sigma.octopart.com:80/reach_statement/Murata-company-16.pdf?src-supplier=Compliance+Statements; ComponentLink12Description: http://sigma.octopart.com:80/reach_statement/Murata-company-16.pdf?src-supplier=Compliance+Statements; Supplier 1: DigiKey; Supplier Part Number 1: 490-4778-1-ND
J1 = B2B-XH-A: To ON BUTTON; Supplier 1: DigiKey; Supplier Part Number 1: 455-B2B-XH-A-ND
J2 = B2B-XH-A: To POWER; Supplier 1: DigiKey; Supplier Part Number 1: 455-B2B-XH-A-ND
J3 J4 J6 = B4B-XH-A: To MOTOR COILS; Supplier 1: DigiKey; Supplier Part Number 1: 455-B4B-XH-A-ND
L1 = SRP4020TA-100M: Ind Power Shielded Wirewound 10uH 20% 100KHz Carbonyl Powder 1.8A T/R; Manufacturer: Bourns; DC Resistance (DCR): 243mΩ; Value: 10µH; Number of Circuits: 1; Q Factor: 10; Saturation Current: 2.3A; Self Resonant Frequency: 19MHz; Supplier: DigiKey; Supplier Part Number: SRP4020TA-100MCT-ND; Manufacturer Part Number: SRP4020TA-100M; RoHS: Compliant; Category: Fixed Inductors; Stock: 52; Pricing: 1=1.07, 10=0.88, 25=0.8136, 50=0.7672, 100=0.7233, 250=0.6692, 500=0.63098, 1000=0.59498 (USD); Case/Package: 1816; China RoHS: Compliant; Composition: Wirewound; Contact Plating: Tin; Core Material: Carbonyl Powder; Current Rating: 1.8A; Depth: 4.06mm; Height: 1.8mm; Height - Seated (Max): 2.0066mm; Inductance Tolerance: 20%; Length: 4.45mm; Lifecycle Status: Production; Max Current Rating: 1.8A; Max DC Current: 1.8A; Max Operating Temperature: 150°C; Min Operating Temperature: -55°C; Mounting Technology: Surface Mount; Pins: 2; Number of Terminals: 2; Ratings: AEC-Q200; REACH SVHC: Yes; RMS Current (Irms): 1.8A; Schedule B: 8504500000, 8504500000|8504500000|8504500000|8504500000|8504500000; Shielding: Shielded; Termination: SMD/SMT; Test Frequency: 100kHz; Tolerance: 20%; Width: 4.06mm; ComponentLink1URL: https://datasheet.octopart.com:443/SRP4020TA-100M-Bourns-datasheet-170574725.pdf?src-supplier=HQonline; ComponentLink1Description: https://datasheet.octopart.com:443/SRP4020TA-100M-Bourns-datasheet-170574725.pdf?src-supplier=HQonline; ComponentLink2URL: https://datasheet.octopart.com:443/SRP4020TA-100M-Bourns-datasheet-57227486.pdf?src-supplier=Newark; ComponentLink2Description: https://datasheet.octopart.com:443/SRP4020TA-100M-Bourns-datasheet-57227486.pdf?src-supplier=Newark; ComponentLink3URL: https://datasheet.octopart.com:443/SRP4020TA-100M-Bourns-datasheet-27843836.pdf?src-supplier=Newark; ComponentLink3Description: https://datasheet.octopart.com:443/SRP4020TA-100M-Bourns-datasheet-27843836.pdf?src-supplier=Newark; ComponentLink4URL: https://datasheet.octopart.com:443/SRP4020TA-100M-Bourns-datasheet-154729956.pdf?src-supplier=Electro+Sonic; ComponentLink4Description: https://datasheet.octopart.com:443/SRP4020TA-100M-Bourns-datasheet-154729956.pdf?src-supplier=Electro+Sonic; ComponentLink5URL: http://sigma.octopart.com:80/conflict_mineral_statement/Bourns-company-36.pdf?src-supplier=Compliance+Statements; ComponentLink5Description: http://sigma.octopart.com:80/conflict_mineral_statement/Bourns-company-36.pdf?src-supplier=Compliance+Statements; Supplier 1: DigiKey; Supplier Part Number 1: SRP4020TA-100MCT-ND
R1 = RC0805FR-071KL: Yageo RC0805FR-071KL SMD Resistor 0603 1k Ohm ±1% Thick Film; Manufacturer: Yageo Group; Max Power Dissipation: 125mW; Value: 1kΩ; Temperature Coefficient: 100ppm/°C; Voltage Rating: 150V; Supplier: DigiKey; Supplier Part Number: 311-1.00KCRCT-ND; Manufacturer Part Number: RC0805FR-071KL; RoHS: Compliant; Category: Chip SMD Resistors; Stock: 169387; Pricing: 1=0.1, 10=0.034, 25=0.0256, 50=0.0208, 100=0.0171, 250=0.01344, 500=0.01136, 1000=0.00973 (USD); Case/Package: 0805; Case Code (Imperial): 0805; China RoHS: Non-Compliant; Composition: Thick Film; Contact Plating: Tin; Country of Origin: Mainland China, Taiwan; Depth: 1.25mm; Export Control Classification Number (ECCN) Code: EAR99; Features: Moisture Resistant; Height: 500µm; Harmonized Tariff Schedule (HTS) Code: 8533.21.00.30; Introduction Date: 2004-09-22; Lead Free: Lead Free; Length: 2mm; Lifecycle Status: Production; Max Operating Temperature: 155°C; Military Standard: Not; Min Operating Temperature: -55°C; Mounting Technology: Surface Mount; Pins: 2; Number of Terminals: 2; Number of Terminations: 2; Packaging: Tape & Reel; Power Rating: 125mW; Radiation Hardening: No; REACH SVHC: Yes; Schedule B: 8533210045, 8533210045|8533210045, 8533210045|8533210045|8533210045, 8533210045|8533210045|8533210045|8533210045; Termination: SMD/SMT; Tolerance: 1%; Voltage Rating (AC): 150V; Voltage Rating (DC): 150V; Width: 1.25mm; Working Voltage: 150V; ComponentLink1URL: https://datasheet.octopart.com:443/RC0805FR-071KL-Yageo-datasheet-175887523.pdf?src-supplier=IHS; ComponentLink1Description: https://datasheet.octopart.com:443/RC0805FR-071KL-Yageo-datasheet-175887523.pdf?src-supplier=IHS; ComponentLink2URL: https://datasheet.octopart.com:443/RC0805FR-071KL-Yageo-datasheet-103092701.pdf?src-supplier=Upverter; ComponentLink2Description: https://datasheet.octopart.com:443/RC0805FR-071KL-Yageo-datasheet-103092701.pdf?src-supplier=Upverter; ComponentLink3URL: https://datasheet.octopart.com:443/RC0805FR-071KL-Yageo-datasheet-8330313.pdf?src-supplier=element14+APAC; ComponentLink3Description: https://datasheet.octopart.com:443/RC0805FR-071KL-Yageo-datasheet-8330313.pdf?src-supplier=element14+APAC; ComponentLink4URL: https://datasheet.octopart.com:443/RC0805FR-071KL-Yageo-datasheet-62067350.pdf?src-supplier=element14+APAC; ComponentLink4Description: https://datasheet.octopart.com:443/RC0805FR-071KL-Yageo-datasheet-62067350.pdf?src-supplier=element14+APAC; ComponentLink5URL: https://datasheet.octopart.com:443/RC0805FR-071KL-Yageo-datasheet-12592811.pdf?src-supplier=element14+APAC; ComponentLink5Description: https://datasheet.octopart.com:443/RC0805FR-071KL-Yageo-datasheet-12592811.pdf?src-supplier=element14+APAC; ComponentLink6URL: https://datasheet.octopart.com:443/RC0805FR-071KL-Yageo-Group-datasheet-190305687.pdf?src-supplier=Newark; ComponentLink6Description: https://datasheet.octopart.com:443/RC0805FR-071KL-Yageo-Group-datasheet-190305687.pdf?src-supplier=Newark; ComponentLink7URL: https://datasheet.octopart.com:443/RC0805FR-071KL-Yageo-Group-datasheet-176638170.pdf?src-supplier=Future+Electronics; ComponentLink7Description: https://datasheet.octopart.com:443/RC0805FR-071KL-Yageo-Group-datasheet-176638170.pdf?src-supplier=Future+Electronics; ComponentLink8URL: https://datasheet.octopart.com:443/RC0805FR-071KL-Yageo-datasheet-164759695.pdf?src-supplier=Future+Electronics; ComponentLink8Description: https://datasheet.octopart.com:443/RC0805FR-071KL-Yageo-datasheet-164759695.pdf?src-supplier=Future+Electronics; ComponentLink9URL: https://datasheet.octopart.com:443/RC0805FR-071KL-Yageo-datasheet-8324252.pdf?src-supplier=Future+Electronics; ComponentLink9Description: https://datasheet.octopart.com:443/RC0805FR-071KL-Yageo-datasheet-8324252.pdf?src-supplier=Future+Electronics; ComponentLink10URL: https://datasheet.octopart.com:443/RC0805FR-071KL-Yageo-datasheet-79472498.pdf?src-supplier=Megastar; ComponentLink10Description: https://datasheet.octopart.com:443/RC0805FR-071KL-Yageo-datasheet-79472498.pdf?src-supplier=Megastar; ComponentLink11URL: https://datasheet.octopart.com/RC0805FR-071KL-Yageo-datasheet-73766026.pdf; ComponentLink11Description: https://datasheet.octopart.com/RC0805FR-071KL-Yageo-datasheet-73766026.pdf; ComponentLink12URL: https://datasheet.octopart.com:443/RC0805FR-071KL-Yageo-datasheet-13691069.pdf?src-supplier=Farnell; ComponentLink12Description: https://datasheet.octopart.com:443/RC0805FR-071KL-Yageo-datasheet-13691069.pdf?src-supplier=Farnell; ComponentLink13URL: https://datasheet.octopart.com:443/RC0805FR-071KL-Yageo-datasheet-118657.pdf?src-supplier=DigiKey; ComponentLink13Description: https://datasheet.octopart.com:443/RC0805FR-071KL-Yageo-datasheet-118657.pdf?src-supplier=DigiKey; ComponentLink14URL: https://datasheet.octopart.com:443/RC0805FR-071KL-Yageo-datasheet-502840.pdf?src-supplier=element14; ComponentLink14Description: https://datasheet.octopart.com:443/RC0805FR-071KL-Yageo-datasheet-502840.pdf?src-supplier=element14; ComponentLink15URL: http://sigma.octopart.com:80/conflict_mineral_statement/Yageo-company-3.pdf?src-supplier=Compliance+Statements; ComponentLink15Description: http://sigma.octopart.com:80/conflict_mineral_statement/Yageo-company-3.pdf?src-supplier=Compliance+Statements; ComponentLink16URL: http://sigma.octopart.com:80/rohs_statement/Yageo-company-2.pdf?src-supplier=Compliance+Statements; ComponentLink16Description: http://sigma.octopart.com:80/rohs_statement/Yageo-company-2.pdf?src-supplier=Compliance+Statements; Supplier 1: DigiKey; Supplier Part Number 1: 311-1.00KCRCT-ND